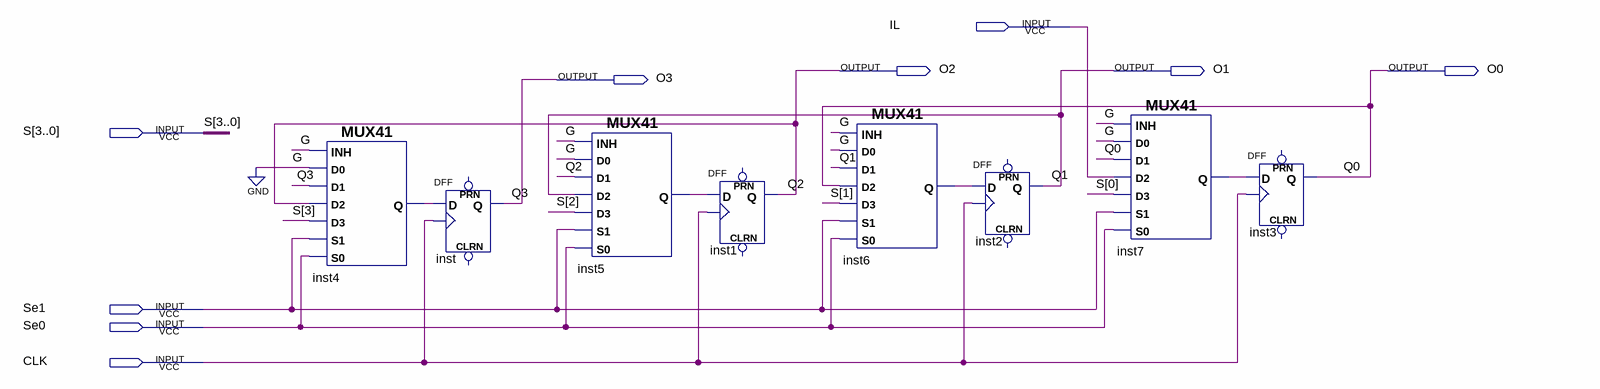
[diagram p0: schematic sheet]
// Quartus schematic 4sl.bdf as structural Verilog: 8 symbols, 9 pins
module \4sl  (
  input  IL,
  input  [3:0] S,
  input  Se1,
  input  Se0,
  input  CLK,
  output O2,
  output O1,
  output O0,
  output O3
);

  wire inst4_q, inst5_q, inst6_q, inst7_q;

  MUX41 inst4 (.S0(Se0), .D2(O2), .S1(Se1), .D3(S[3]), .D0(1'b0), .INH(1'b0), .D1(O3), .Q(inst4_q));
  DFF inst (.CLK(CLK), .D(inst4_q), .Q(O3));  // open: CLRN, PRN
  MUX41 inst5 (.S0(Se0), .D2(O1), .S1(Se1), .D3(S[2]), .D0(1'b0), .INH(1'b0), .D1(O2), .Q(inst5_q));
  DFF inst1 (.CLK(CLK), .D(inst5_q), .Q(O2));  // open: CLRN, PRN
  MUX41 inst6 (.S0(Se0), .D2(O0), .S1(Se1), .D3(S[1]), .D0(1'b0), .INH(1'b0), .D1(O1), .Q(inst6_q));
  DFF inst2 (.CLK(CLK), .D(inst6_q), .Q(O1));  // open: CLRN, PRN
  MUX41 inst7 (.S0(Se0), .D2(IL), .S1(Se1), .D3(S[0]), .D0(1'b0), .INH(1'b0), .D1(O0), .Q(inst7_q));
  DFF inst3 (.CLK(CLK), .D(inst7_q), .Q(O0));  // open: CLRN, PRN

  // Other names for the same wires on the sheet: Q0 = O0; Q1 = O1; Q2 = O2; Q3 = O3
endmodule
